# Altium schematic sheet ATGM336H-5N31.schdoc
size 56 x 50 mm
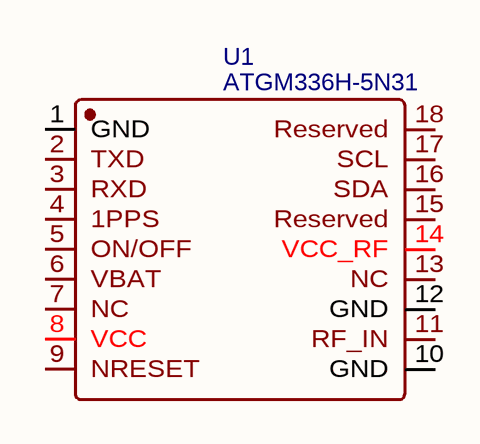
[diagram p0: ATGM336H-5N31.schdoc]

## Parts
U1  ATGM336H-5N31  [GPSM-SMD_ATGM336H-TR]

## Nets

Not connected (* = marked no-connect by the designer): U1 1(GND) 2(TXD) 3(RXD) 4(1PPS) 5(ON/OFF) 6(VBAT) 7(NC) 8(VCC) 9(NRESET) 10(GND) 11(RF_IN) 12(GND) 13(NC) 14(VCC_RF) 15(Reserved) 16(SDA) 17(SCL) 18(Reserved)

## Library data of the parts
U1 = ATGM336H-5N31: Manufacturer: 杭州中科微; Supplier: LCSC; Manufacturer Part: ATGM336H-5N31; Supplier Part: C90770; JLCPCB Part Class: Extended Part; spicePre: U; spiceSymbolName: ATGM336H-5N31